# Altium project maylockhong khi.PrjPcb
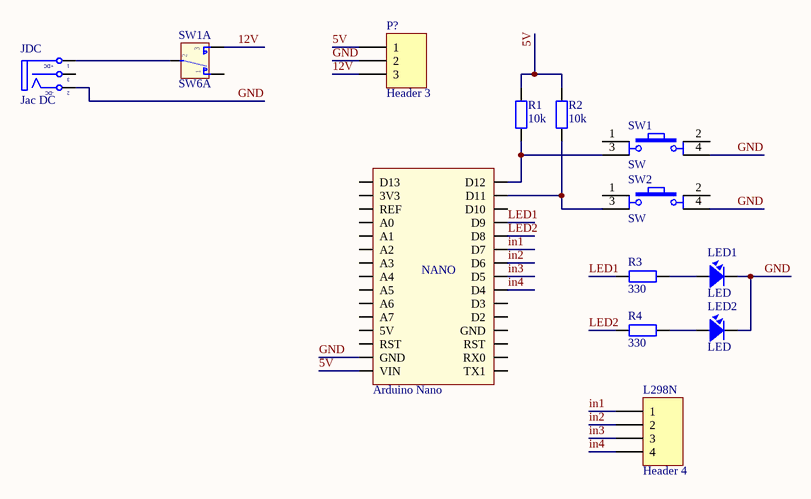
[diagram p0: Sheet2.SchDoc]
1 sheet, 13 parts. Net scope: global (net labels, ports and power ports of the same name join across sheets).
Board file: PCB2.PcbDoc

## Sheet Sheet2.SchDoc
size A

### Parts
(Parts that share a designator on the sheet are numbered #1, #2 ... from top to bottom, then left to right.)
Arduino_Nano  Arduino Nano  [Arduino Nano]  (value not drawn)
JDC  Jac DC  [DC-IN]
L298N  Header 4  [HDR1X4]
LED1  LED  [LED-5 GRe]
LED2  LED  [LED-5 GRe]
P?  Header 3  [HDR1X3]
R1  10k  [R1/4W]
R2  10k  [R1/4W]
R3  330  [R1/4W]
R4  330  [R1/4W]
SW1#1  SW6A  [SW6]  (part A of 2)
SW1#2  SW  [SW4]
SW2  SW  [SW4]

### Nets
5V: Arduino_Nano.VIN P?.1 R1.2 R2.2
12V: P?.3 SW1#1.3
GND: Arduino_Nano.GND JDC.2(TN) LED1.2 LED2.2 P?.2 SW1#2.4 SW2.4
in1: Arduino_Nano.D7 L298N.1
in2: Arduino_Nano.D6 L298N.2
in3: Arduino_Nano.D5 L298N.3
in4: Arduino_Nano.D4 L298N.4
LED1: Arduino_Nano.D9 R3.1
LED2: Arduino_Nano.D8 R4.1
NetArduino_Nano_D11: Arduino_Nano.D11 R2.1 SW2.3
NetArduino_Nano_D12: Arduino_Nano.D12 R1.1 SW1#2.3
NetJDC_1: JDC.1(T) SW1#1.2
NetLED1_1: LED1.1 R3.2
NetLED2_1: LED2.1 R4.2

Not connected (* = marked no-connect by the designer): Arduino_Nano 3V3 5V A0 A1 A2 A3 A4 A5 A6 A7 D2 D3 D10 D13 REF RST RX0 TX1; JDC 3(S); SW1#1 1; SW1#2 1 2; SW2 1 2

### Notes on the sheet
- (in symbol Arduino Nano) NANO
- (in symbol DCIN) +DC; -DC

### Library data of the parts
Arduino_Nano = Arduino Nano: Value: Cau 1A
JDC = DCIN: Jac DC input; Value: Jac DC
L298N = Header 4: Header, 4-Pin; LatestRevisionDate: 17-Jul-2002; LatestRevisionNote: Re-released for DXP Platform.; Publisher: Altium Limited
LED1 LED2 = LED: LED Single colour Green and Red; Value: LED 3 ly Single Colour
P? = Header 3: Header, 3-Pin; LatestRevisionDate: 17-Jul-2002; LatestRevisionNote: Re-released for DXP Platform.; Publisher: Altium Limited
R1-R4 = R1/4W: Resistor 1/4W; Value: R1/4W - 1K
SW1#1 = SW6A: SW-DTDP - 6 Pin; Value: SW6
SW1#2 SW2 = SW4: Switch button 4 pin; Value: Button chip 4 pin